# EAGLE schematic Franzininho v35 (EAGLE 9.7.0)
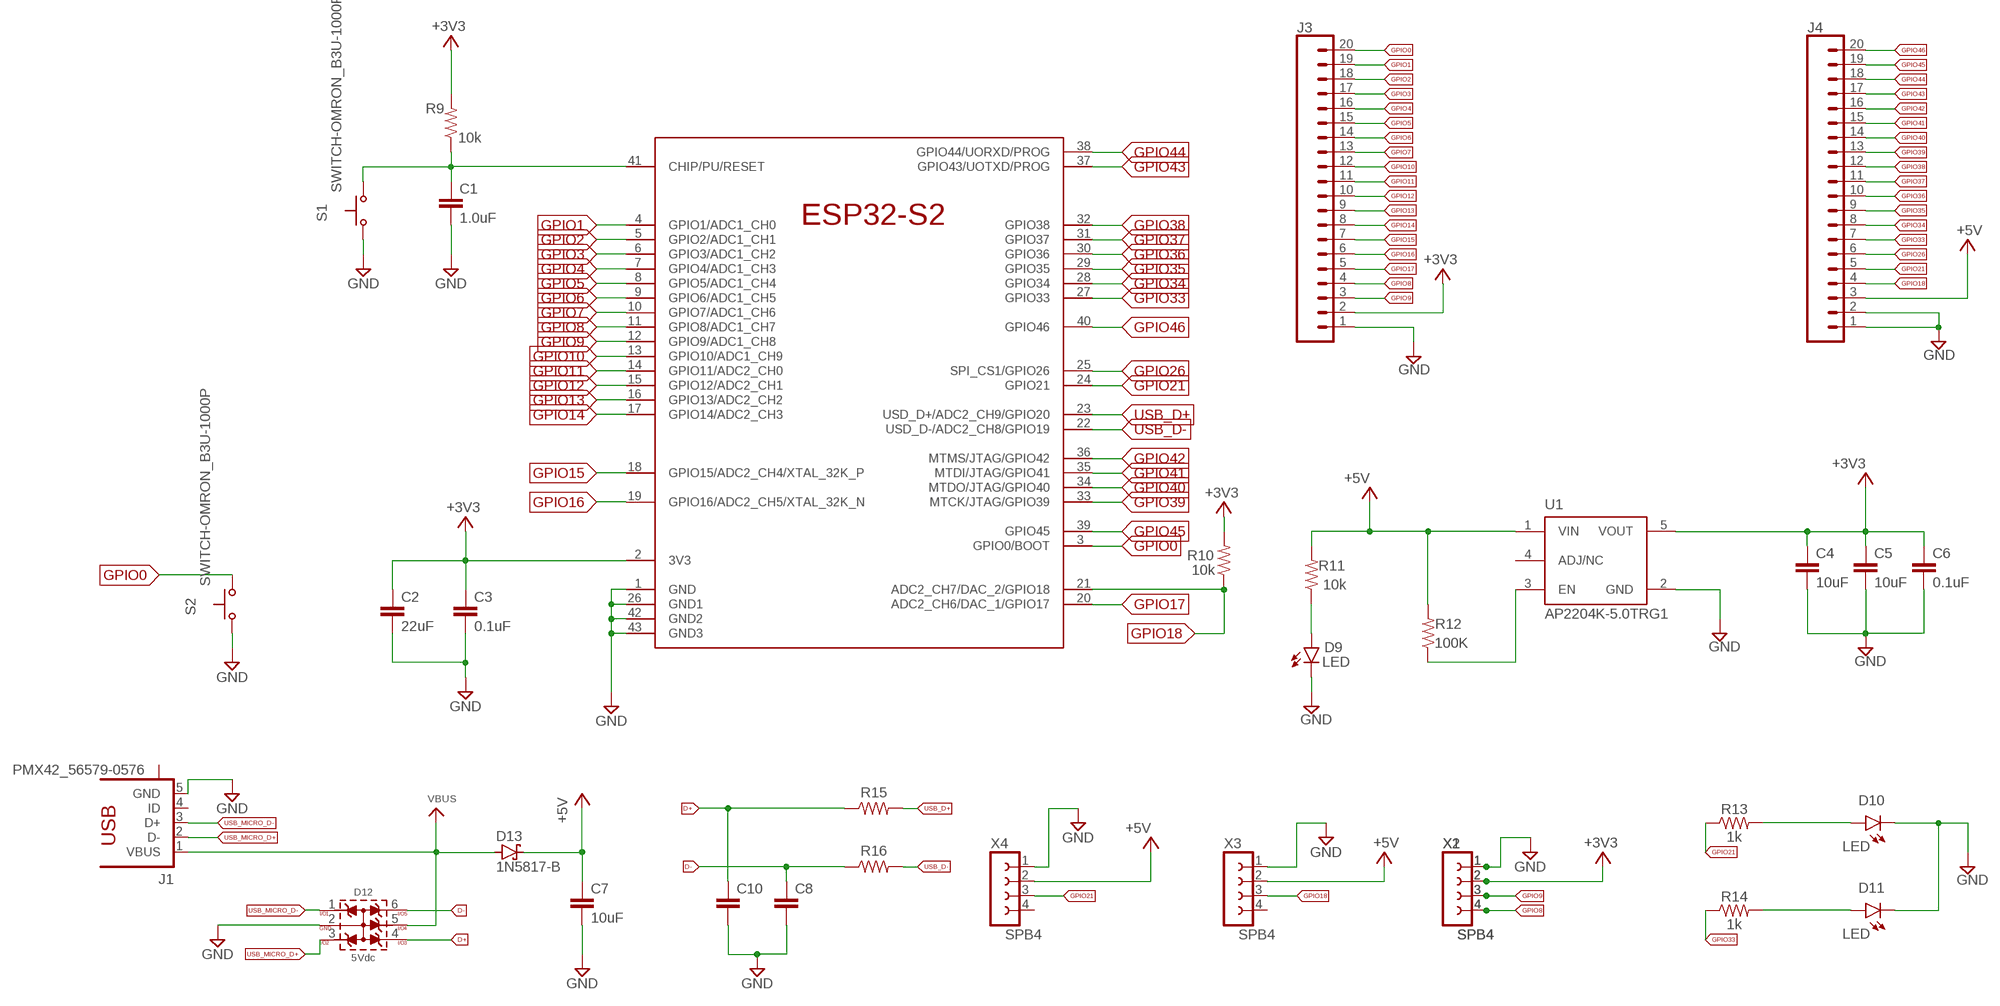
[diagram p0: schematic, sheet 1]

## Parts
C1  1.0uF  1.0UF-0805-25V-10%  [0805]
C2  22uF  22UF-1210-16V-20%  [1210]
C3  0.1uF  0.1UF-0603-100V-10%  [0603]
C4  10uF  10UF-1210-50V-20%  [1210]
C5  10uF  10UF-1210-50V-20%  [1210]
C6  0.1uF  0.1UF-0603-100V-10%  [0603]
C7  10uF  10UF-1210-50V-20%  [1210]
C8  18pF  18PF-0603-50V-5%  [0603]
C10  18pF  18PF-0603-50V-5%  [0603]
D9  LED  LED_RADIAL  [LEDRD254W60D565H860B_G]
D10  LED  LED_RADIAL  [LEDRD254W60D565H860B_G]
D11  LED  LED_RADIAL  [LEDRD254W60D565H860B_G]
D12  5Vdc  WE-TVS_SOT23-6L_82402305  [WE-TVS_SOT23-6L]
D13  1N5817-B  [DO41-7.6]
J1  PMX42_56579-0576  [PMX42_56579-0576]
J3  CONN_20NOSILK  [1X20_NOSILK]
J4  CONN_20NOSILK  [1X20_NOSILK]
R9  10k  R-US_AXIAL-7.2MM-PITCH  [RESAD724W46L381D178B]
R10  10k  10KOHM-0603-1/10W-1%  [0603]
R11  10k  10KOHM-0603-1/10W-1%  [0603]
R12  100K  100KOHM-0402-1/16W-1%  [0402]
R13  1k  1KOHM-0603-1/10W-1%  [0603]
R14  1k  1KOHM-0603-1/10W-1%  [0603]
R15  R-US_AXIAL-7.2MM-PITCH  [RESAD724W46L381D178B]
R16  R-US_AXIAL-7.2MM-PITCH  [RESAD724W46L381D178B]
S1  SWITCH-OMRON_B3U-1000P  [SWITCH-OMRON_B3U-1000P]
S2  SWITCH-OMRON_B3U-1000P  [SWITCH-OMRON_B3U-1000P]
U1  AP2204K-5.0TRG1  [SOT-23-5]
U2  ESP32  [QFN48-0.4MM]
X1  SPB4  [SPB4]
X2  SPB4  [SPB4]
X3  SPB4  [SPB4]
X4  SPB4  [SPB4]

## Nets
+3V3: C2.1 C3.1 C4.1 C5.1 C6.1 J3.2 R9.2 R10.2 U1.5(VOUT) U2.2(3V3) X1.2 X2.2
+5V: C7.1 D13.C J4.3 R11.2 R12.2 U1.1(VIN) X3.2 X4.2
D+: C10.1 D12.4 R15.1
D-: C8.1 D12.6 R16.1
GND: C1.2 C2.2 C3.2 C4.2 C5.2 C6.2 C7.2 C8.2 C10.2 D9.2(C) D10.2(C) D11.2(C) D12.2(GND) J1.5(GND) J3.1 J4.1 J4.2 S1.1(P) S2.1(P) U1.2(GND) U2.1(GND) U2.26(GND1) U2.42(GND2) U2.43(GND3) X1.1 X2.1 X3.1 X4.1
GPIO0: J3.20 S2.2(S) U2.3(GPIO0/BOOT)
GPIO1: J3.19 U2.4(GPIO1/ADC1_CH0)
GPIO2: J3.18 U2.5(GPIO2/ADC1_CH1)
GPIO3: J3.17 U2.6(GPIO3/ADC1_CH2)
GPIO4: J3.16 U2.7(GPIO4/ADC1_CH3)
GPIO5: J3.15 U2.8(GPIO5/ADC1_CH4)
GPIO6: J3.14 U2.9(GPIO6/ADC1_CH5)
GPIO7: J3.13 U2.10(GPIO7/ADC1_CH6)
GPIO8: J3.4 U2.11(GPIO8/ADC1_CH7) X1.4 X2.4
GPIO9: J3.3 U2.12(GPIO9/ADC1_CH8) X1.3 X2.3
GPIO10: J3.12 U2.13(GPIO10/ADC1_CH9)
GPIO11: J3.11 U2.14(GPIO11/ADC2_CH0)
GPIO12: J3.10 U2.15(GPIO12/ADC2_CH1)
GPIO13: J3.9 U2.16(GPIO13/ADC2_CH2)
GPIO14: J3.8 U2.17(GPIO14/ADC2_CH3)
GPIO15: J3.7 U2.18(GPIO15/ADC2_CH4/XTAL_32K_P)
GPIO16: J3.6 U2.19(GPIO16/ADC2_CH5/XTAL_32K_N)
GPIO17: J3.5 U2.20(ADC2_CH6/DAC_1/GPIO17)
GPIO18: J4.4 R10.1 U2.21(ADC2_CH7/DAC_2/GPIO18) X3.3
GPIO21: J4.5 R13.1 U2.24(GPIO21) X4.3
GPIO26: J4.6 U2.25(SPI_CS1/GPIO26)
GPIO33: J4.7 R14.1 U2.27(GPIO33)
GPIO34: J4.8 U2.28(GPIO34)
GPIO35: J4.9 U2.29(GPIO35)
GPIO36: J4.10 U2.30(GPIO36)
GPIO37: J4.11 U2.31(GPIO37)
GPIO38: J4.12 U2.32(GPIO38)
GPIO39: J4.13 U2.33(MTCK/JTAG/GPIO39)
GPIO40: J4.14 U2.34(MTDO/JTAG/GPIO40)
GPIO41: J4.15 U2.35(MTDI/JTAG/GPIO41)
GPIO42: J4.16 U2.36(MTMS/JTAG/GPIO42)
GPIO43: J4.17 U2.37(GPIO43/UOTXD/PROG)
GPIO44: J4.18 U2.38(GPIO44/UORXD/PROG)
GPIO45: J4.19 U2.39(GPIO45)
GPIO46: J4.20 U2.40(GPIO46)
N$9: C1.1 R9.1 S1.2(S) U2.41(CHIP/PU/RESET)
N$12: D9.1(A) R11.1
N$13: R12.1 U1.3(EN)
N$14: D10.1(A) R13.2
N$15: D11.1(A) R14.2
USB_D+: R15.2 U2.23(USD_D+/ADC2_CH9/GPIO20)
USB_D-: R16.2 U2.22(USD_D-/ADC2_CH8/GPIO19)
USB_MICRO_D+: D12.3 J1.2(D-)
USB_MICRO_D-: D12.1 J1.3(D+)
VBUS: D12.5 D13.A J1.1(VBUS)
Unconnected: J1.4(ID) J1.S1(S) J1.S2(S) J1.S3(S) J1.S4(S) U1.4(ADJ/NC) X3.4 X4.4

## Library data of the parts
C1 = SparkFun-Capacitors:1.0UF: 1µF ceramic capacitors A capacitor is a passive two-terminal electrical component used to store electrical energy temporarily in an electric field.; PROD_ID: CAP-08064; SPICEPREFIX: C
C2 = SparkFun-Capacitors:22UF: 22µF ceramic capacitors A capacitor is a passive two-terminal electrical component used to store electrical energy temporarily in an electric field.; SPICEPREFIX: C
C3 C6 = SparkFun-Capacitors:0.1UF: 0.1µF ceramic capacitors A capacitor is a passive two-terminal electrical component used to store electrical energy temporarily in an electric field.; PROD_ID: CAP-08390
C4 C5 C7 = SparkFun-Capacitors:10UF: 10.0µF ceramic capacitors A capacitor is a passive two-terminal electrical component used to store electrical energy temporarily in an electric field.; PROD_ID: CAP-09824
C8 C10 = SparkFun-Capacitors:18PF: 18pF ceramic capacitors A capacitor is a passive two-terminal electrical component used to store electrical energy temporarily in an electric field.; PROD_ID: CAP-08267
D9-D11 = Library:LED_RADIAL: LED - Generic
D12 = Wurth_EMC Components_WE-TVS:WE-TVS_SOT23-6L_82402305: WE-TVS TVS Diode – Standard Series Characteristics Fast turn-on Low clamping voltage High ESD withstand voltage Uni- or bidirectional protection Small package Epoxy flame resistant UL94 V-0 Applications DC power supply USB Power Delivery (PD) Headsets and accessories PDAs Digital cameras MP3-Player Touch Panels Notebooks ESD, EFT and Surge Protection ESD protection in accordance with EN 61000-4-2 – 8 kV contact discharge – 15 kV air discharge <https://www.we-online.com/catalog/media/o106433v209%20Family_WE-TVS_Standard.jpg> Details see: https://www.we-online.com/catalog/en/WE-TVS Updated by Ella Wu 2019-07-12 2019 (C) Wurth Elektronik; C-CH: 13pF; CHANNELS: 5; DATASHEET-URL: https://www.we-online.com/catalog/datasheet/82402305.pdf; IPEAK: 6A; MOUNT: SMT; PART-NUMBER: 82402305; VBR: 6V
D13 = diode:1N581*: 1.0A SCHOTTKY BARRIER RECTIFIER Source: http://www.diodes.com/datasheets/ds23001.pdf
J1 = 52101-101-REV-A_v16:PMX42_56579-0576: USB - OTG, miniUSB Type AB, Molex
J3 J4 = SparkFun-Connectors:CONN_20: Multi connection point. Often used as Generic Header-pin footprint for 0.1 inch spaced/style header connections On any of the 0.1 inch spaced packages, you can populate with these: Break Away Headers - Straight <https://www.sparkfun.com/products/116> (PRT-00116) Break Away Male Headers - Right Angle <https://www.sparkfun.com/products/553> (PRT-00553) Female Headers <https://www.sparkfun.com/products/115> (PRT-00115) Break Away Headers - Machine Pin <https://www.sparkfun.com/products/117> (PRT-00117) Break Away Female Headers - Swiss Machine Pin <https://www.sparkfun.com/products/743> (PRT-00743) For SCREWTERMINALS and SPRING TERMINALS visit here: Screw Terimnals on SparkFun.com <https://www.sparkfun.com/search/results?term=Screw+Terminals> (5mm/3.5mm/2.54mm spacing) This device is also useful as a general connection point to wire up your design to another part of your project. Our various solder wires solder well into these plated through hole pads. Hook-Up Wire - Assortment (Stranded, 22 AWG) <https://www.sparkfun.com/products/11375> (PRT-11375) Hook-Up Wire - Assortment (Solid Core, 22 AWG) <https://www.sparkfun.com/products/11367> (PRT-11367) View the entire wire category on our website here <https://www.sparkfun.com/categories/141> Special notes: Molex polarized connector foot print use with SKU : PRT-08231 with associated crimp pins and housings. 1MM SMD Version SKU: PRT-10208 NOTES ON THE VARIANTS LOCK and LOCK_LONGPADS... This footprint was designed to help hold the alignment of a through-hole component (i.e. 6-pin header) while soldering it into place. You may notice that each hole has been shifted either up or down by 0.005 of an inch from it's more standard position (which is a perfectly straight line). This slight alteration caused the pins (the squares in the middle) to touch the edges of the holes. Because they are alternating, it causes a "brace" to hold the component in place. 0.005 has proven to be the perfect amount of "off-center" position when using our standard breakaway headers. Although looks a little odd when you look at the bare footprint, once you have a header in there, the alteration is very hard to notice. Also,if you push a header all the way into place, it is covered up entirely on the bottom side. Note about LOCK SPECIAL package: This is just like the LOCK variant in that the holes are staggared by 5 mil, but except for the last two holes. They are not altered from the "standard" footprint layout. This is used for a special purpose on the layout of our Graphic LCD Backpack. Make sure you want to use this device before selecting it for you project!
R9 = Resistor:R-US: Resistor Fixed - ANSI; CATEGORY: Resistor; SPICEPREFIX: R; SUB-CATEGORY: Fixed
R10 = SparkFun-Resistors:10KOHM: 10kΩ resistor A resistor is a passive two-terminal electrical component that implements electrical resistance as a circuit element. Resistors act to reduce current flow, and, at the same time, act to lower voltage levels within circuits. - Wikipedia; PROD_ID: RES-00824; SPICEPREFIX: R
R11 = SparkFun-Resistors:10KOHM: 10kΩ resistor A resistor is a passive two-terminal electrical component that implements electrical resistance as a circuit element. Resistors act to reduce current flow, and, at the same time, act to lower voltage levels within circuits. - Wikipedia; PROD_ID: RES-00824
R12 = SparkFun-Resistors:100KOHM: 100kΩ resistor A resistor is a passive two-terminal electrical component that implements electrical resistance as a circuit element. Resistors act to reduce current flow, and, at the same time, act to lower voltage levels within circuits. - Wikipedia; PROD_ID: RES-13495
R13 R14 = SparkFun-Resistors:1KOHM: 1kΩ resistor A resistor is a passive two-terminal electrical component that implements electrical resistance as a circuit element. Resistors act to reduce current flow, and, at the same time, act to lower voltage levels within circuits. - Wikipedia; PROD_ID: RES-07856
R15 R16 = Resistor:R-US: Resistor Fixed - ANSI; CATEGORY: Resistor; SUB-CATEGORY: Fixed
S1 S2 = 52101-101-REV-A_v16:SWITCH-OMRON_B3U-1000P: SMD Tactile Switch - Ultra Small
U1 = LDO:AP2204K-5.0TRG1: IC REG LINEAR 5V 150MA SOT23-5 Manufacturer's datasheet <https://media.digikey.com/pdf/Data%20Sheets/Diodes%20PDFs/AP2204_Jan2020.pdf>; CREATED_BY: PCBLayout.com; DIGIKEY_PARTNO: AP2204K-5.0TRG1DICT-ND; MANUFACTURER: Diodes Incorporated; MPN: AP2204K-5.0TRG1; PACKAGE: SOT-23-5
U2 = Biblioteca ESP32-S2:ESP32: Espressif ESP32 WiFi-compatible SoC microcontroller. Bluetooth Low energy support (BLE, BT4.0, Bluetooth Smart) 28 GPIO pins Dual-core Tensilica LX6 microprocessor Hardware accelerated encryption (AES, SHA2, ECC, RSA-4096) 4MB Flash memory 520kB internal SRAM Datasheet <https://cdn.sparkfun.com/datasheets/IoT/esp32_datasheet_en.pdf> SparkFun Products: SparkFun ESP32 Thing <https://www.sparkfun.com/products/13907>; PROD_ID: IC-13338; SPICEPREFIX: X
X1-X4 = con-hirschmann:SPB4: CONNECTOR 4 pins; OC_FARNELL: unknown; OC_NEWARK: unknown